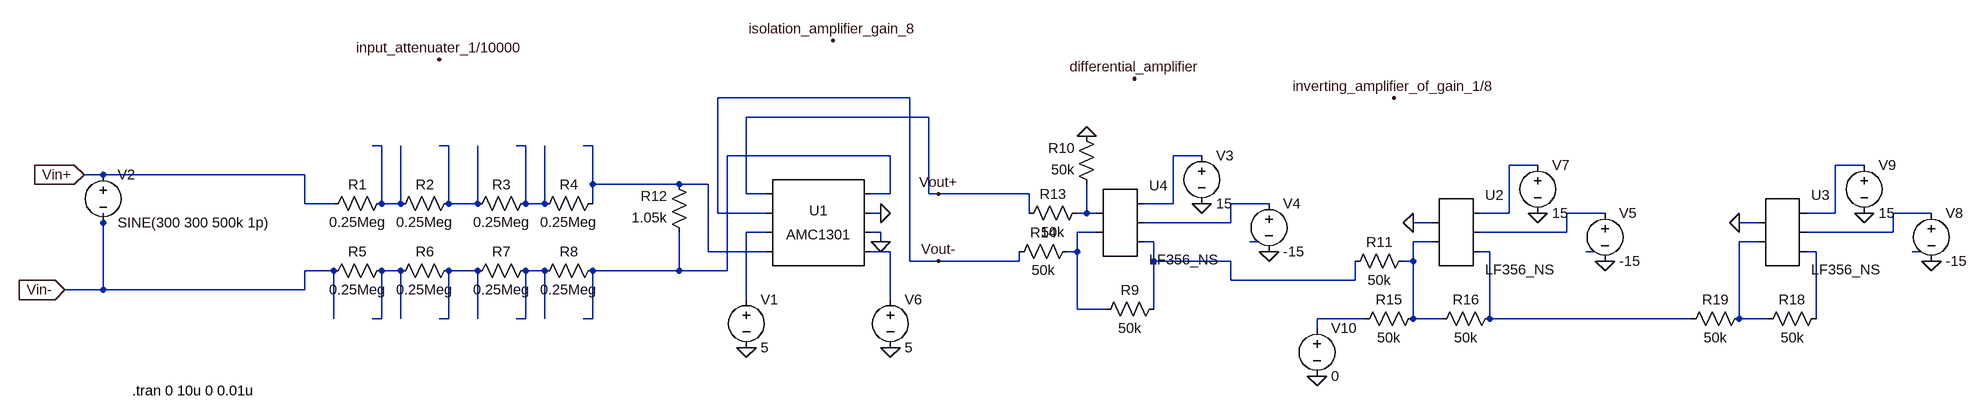
[diagram p0: schematic edl_circuit (1).asc]
edl_circuit (1).asc, the LTspice schematic file:
Version 4
SHEET 1 3028 1588
WIRE 832 -64 512 -64
WIRE 864 -32 560 -32
WIRE -48 16 -64 16
WIRE 64 16 48 16
WIRE 192 16 176 16
WIRE 304 16 288 16
WIRE 800 32 528 32
WIRE 1344 32 1296 32
WIRE 1904 48 1856 48
WIRE 2448 48 2400 48
WIRE -512 64 -544 64
WIRE -176 64 -512 64
WIRE 304 80 304 16
WIRE 448 80 304 80
WIRE 496 80 448 80
WIRE 560 96 560 -32
WIRE 592 96 560 96
WIRE 800 96 800 32
WIRE 800 96 768 96
WIRE 864 96 864 -32
WIRE 880 96 864 96
WIRE 1056 96 880 96
WIRE -176 112 -176 64
WIRE -128 112 -176 112
WIRE -48 112 -48 16
WIRE -16 112 -16 16
WIRE -16 112 -48 112
WIRE 64 112 64 16
WIRE 112 112 112 16
WIRE 112 112 64 112
WIRE 192 112 192 16
WIRE 224 112 224 16
WIRE 224 112 192 112
WIRE 304 112 304 80
WIRE 1296 112 1296 32
WIRE 1296 112 1248 112
WIRE 1456 112 1392 112
WIRE 512 128 512 -64
WIRE 592 128 512 128
WIRE 784 128 768 128
WIRE 1056 128 1056 96
WIRE 1152 128 1152 80
WIRE 1152 128 1136 128
WIRE 1168 128 1152 128
WIRE 1856 128 1856 48
WIRE 1856 128 1808 128
WIRE 2016 128 1952 128
WIRE 2400 128 2400 48
WIRE 2400 128 2352 128
WIRE 2560 128 2496 128
WIRE -512 144 -512 128
WIRE 1392 144 1392 112
WIRE 1392 144 1248 144
WIRE 1728 144 1696 144
WIRE 2272 144 2240 144
WIRE 592 160 560 160
WIRE 784 160 768 160
WIRE 1168 160 1136 160
WIRE 1952 160 1952 128
WIRE 1952 160 1808 160
WIRE 2496 160 2496 128
WIRE 2496 160 2352 160
WIRE 784 176 784 160
WIRE 1264 176 1248 176
WIRE 1440 176 1424 176
WIRE 1728 176 1696 176
WIRE 2272 176 2240 176
WIRE 496 192 496 80
WIRE 592 192 496 192
WIRE 800 192 768 192
WIRE 1136 192 1136 160
WIRE 1136 192 1120 192
WIRE 1824 192 1808 192
WIRE 2000 192 1984 192
WIRE 2368 192 2352 192
WIRE 2544 192 2528 192
WIRE 832 208 832 -64
WIRE 880 208 832 208
WIRE 1040 208 1040 192
WIRE 1040 208 880 208
WIRE 1264 208 1264 176
WIRE 1392 208 1264 208
WIRE 1696 208 1696 176
WIRE 1696 208 1680 208
WIRE -128 224 -176 224
WIRE -16 224 -48 224
WIRE 112 224 64 224
WIRE 224 224 192 224
WIRE 448 224 448 160
WIRE 448 224 304 224
WIRE 528 224 528 32
WIRE 528 224 448 224
WIRE 1392 240 1392 208
WIRE 1600 240 1600 208
WIRE 1600 240 1392 240
WIRE -512 256 -512 144
WIRE -512 256 -576 256
WIRE -176 256 -176 224
WIRE -176 256 -512 256
WIRE 560 272 560 160
WIRE 800 272 800 192
WIRE 1136 288 1136 192
WIRE 1184 288 1136 288
WIRE 1264 288 1264 208
WIRE -128 304 -128 224
WIRE -48 304 -48 224
WIRE -48 304 -64 304
WIRE -16 304 -16 224
WIRE 64 304 64 224
WIRE 64 304 48 304
WIRE 112 304 112 224
WIRE 192 304 192 224
WIRE 192 304 176 304
WIRE 224 304 224 224
WIRE 304 304 304 224
WIRE 304 304 288 304
WIRE 1616 304 1536 304
WIRE 1696 304 1696 208
WIRE 1744 304 1696 304
WIRE 1824 304 1824 192
WIRE 2160 304 1824 304
WIRE 2240 304 2240 176
WIRE 2288 304 2240 304
WIRE 2368 304 2368 192
WIRE 1536 320 1536 304
FLAG 784 176 0
FLAG 560 352 0
FLAG -544 64 Vin+
IOPIN -544 64 In
FLAG -576 256 Vin-
IOPIN -576 256 In
FLAG 880 96 Vout+
FLAG 880 208 Vout-
FLAG 1344 112 0
FLAG 1456 192 0
FLAG 1232 -96 differential_amplifier
FLAG 1664 -64 inverting_amplifier_of_gain_1/8
FLAG 704 -160 isolation_amplifier_gain_8
FLAG 48 -128 input_attenuater_1/10000
FLAG 1152 0 0
FLAG 800 352 0
FLAG 784 128 0
FLAG 1904 128 0
FLAG 2016 208 0
FLAG 1696 144 0
FLAG 2448 128 0
FLAG 2560 208 0
FLAG 2240 144 0
FLAG 1536 400 0
DATAFLAG -416 64 "$-V(Vin-)"
SYMBOL res -32 96 R90
WINDOW 0 0 56 VBottom 2
WINDOW 3 32 56 VTop 2
SYMATTR InstName R1
SYMATTR Value 0.25Meg
SYMBOL res 80 96 R90
WINDOW 0 0 56 VBottom 2
WINDOW 3 32 56 VTop 2
SYMATTR InstName R2
SYMATTR Value 0.25Meg
SYMBOL res 208 96 R90
WINDOW 0 0 56 VBottom 2
WINDOW 3 32 56 VTop 2
SYMATTR InstName R3
SYMATTR Value 0.25Meg
SYMBOL res 320 96 R90
WINDOW 0 0 56 VBottom 2
WINDOW 3 32 56 VTop 2
SYMATTR InstName R4
SYMATTR Value 0.25Meg
SYMBOL res -32 208 R90
WINDOW 0 0 56 VBottom 2
WINDOW 3 32 56 VTop 2
SYMATTR InstName R5
SYMATTR Value 0.25Meg
SYMBOL res 80 208 R90
WINDOW 0 0 56 VBottom 2
WINDOW 3 32 56 VTop 2
SYMATTR InstName R6
SYMATTR Value 0.25Meg
SYMBOL res 208 208 R90
WINDOW 0 0 56 VBottom 2
WINDOW 3 32 56 VTop 2
SYMATTR InstName R7
SYMATTR Value 0.25Meg
SYMBOL res 320 208 R90
WINDOW 0 0 56 VBottom 2
WINDOW 3 32 56 VTop 2
SYMATTR InstName R8
SYMATTR Value 0.25Meg
SYMBOL voltage 560 256 R0
WINDOW 123 0 0 Left 0
WINDOW 39 0 0 Left 0
SYMATTR InstName V1
SYMATTR Value 5
SYMBOL voltage -512 48 R0
WINDOW 39 0 0 Left 0
SYMATTR Value2 AC 10
SYMATTR InstName V2
SYMATTR Value SINE(300 300 500k 1p)
SYMBOL AutoGenerated\\AMC1301 672 144 R0
SYMATTR InstName U1
SYMBOL res 1136 176 R90
WINDOW 0 0 56 VBottom 2
WINDOW 3 32 56 VTop 2
SYMATTR InstName R14
SYMATTR Value 50k
SYMBOL voltage 1456 96 R0
WINDOW 123 0 0 Left 0
WINDOW 39 0 0 Left 0
SYMATTR InstName V4
SYMATTR Value -15
SYMBOL voltage 1344 16 R0
WINDOW 123 0 0 Left 0
WINDOW 39 0 0 Left 0
SYMATTR InstName V3
SYMATTR Value 15
SYMBOL res 1152 112 R90
WINDOW 0 0 56 VBottom 2
WINDOW 3 32 56 VTop 2
SYMATTR InstName R13
SYMATTR Value 50k
SYMBOL AutoGenerated\\LF356_NS 1200 144 R0
SYMATTR InstName U4
SYMBOL res 1280 272 R90
WINDOW 0 0 56 VBottom 2
WINDOW 3 32 56 VTop 2
SYMATTR InstName R9
SYMATTR Value 50k
SYMBOL res 1168 96 R180
WINDOW 0 36 76 Left 2
WINDOW 3 36 40 Left 2
SYMATTR InstName R10
SYMATTR Value 50k
SYMBOL voltage 800 256 R0
WINDOW 123 0 0 Left 0
WINDOW 39 0 0 Left 0
SYMATTR InstName V6
SYMATTR Value 5
SYMBOL res 464 176 R180
WINDOW 0 36 76 Left 2
WINDOW 3 36 40 Left 2
SYMATTR InstName R12
SYMATTR Value 1.05k
SYMBOL res 1696 192 R90
WINDOW 0 0 56 VBottom 2
WINDOW 3 32 56 VTop 2
SYMATTR InstName R11
SYMATTR Value 50k
SYMBOL voltage 2016 112 R0
WINDOW 123 0 0 Left 0
WINDOW 39 0 0 Left 0
SYMATTR InstName V5
SYMATTR Value -15
SYMBOL voltage 1904 32 R0
WINDOW 123 0 0 Left 0
WINDOW 39 0 0 Left 0
SYMATTR InstName V7
SYMATTR Value 15
SYMBOL AutoGenerated\\LF356_NS 1760 160 R0
SYMATTR InstName U2
SYMBOL res 1840 288 R90
WINDOW 0 0 56 VBottom 2
WINDOW 3 32 56 VTop 2
SYMATTR InstName R16
SYMATTR Value 50k
SYMBOL res 1712 288 R90
WINDOW 0 0 56 VBottom 2
WINDOW 3 32 56 VTop 2
SYMATTR InstName R15
SYMATTR Value 50k
SYMBOL voltage 2560 112 R0
WINDOW 123 0 0 Left 0
WINDOW 39 0 0 Left 0
SYMATTR InstName V8
SYMATTR Value -15
SYMBOL voltage 2448 32 R0
WINDOW 123 0 0 Left 0
WINDOW 39 0 0 Left 0
SYMATTR InstName V9
SYMATTR Value 15
SYMBOL AutoGenerated\\LF356_NS 2304 160 R0
SYMATTR InstName U3
SYMBOL res 2384 288 R90
WINDOW 0 0 56 VBottom 2
WINDOW 3 32 56 VTop 2
SYMATTR InstName R18
SYMATTR Value 50k
SYMBOL res 2256 288 R90
WINDOW 0 0 56 VBottom 2
WINDOW 3 32 56 VTop 2
SYMATTR InstName R19
SYMATTR Value 50k
SYMBOL voltage 1536 304 R0
WINDOW 123 0 0 Left 0
WINDOW 39 0 0 Left 0
SYMATTR InstName V10
SYMATTR Value 0
TEXT -464 424 Left 2 !.tran 0 10u 0 0.01u

The netlist it stands for:
* edl_circuit (1).asc
R1 N001 Vin+ 0.25Meg
R2 N002 N001 0.25Meg
R3 N003 N002 0.25Meg
R4 N004 N003 0.25Meg
R5 N024 Vin- 0.25Meg
R6 N025 N024 0.25Meg
R7 N026 N025 0.25Meg
R8 N005 N026 0.25Meg
V1 N013 0 5
V2 Vin+ Vin- SINE(300 300 500k 1p) AC 10
* U1: AMC1301 (symbol AutoGenerated\AMC1301 not available, pins judged from their places): pin1=Vout+ pin2=Vout- pin3=N013 pin4=N004 pin5=N005 pin6=0 pin7=0 pin8=N019
R14 N014 Vout- 50k
V4 N009 0 -15
V3 N006 0 15
R13 N010 Vout+ 50k
* U4: LF356_NS (symbol AutoGenerated\LF356_NS not available, pins judged from their places): pin1=N010 pin2=N014 pin3=N006 pin4=N009 pin5=N015
R9 N015 N014 50k
R10 N010 0 50k
V6 N019 0 5
R12 N005 N004 1.05k
R11 N017 N015 50k
V5 N011 0 -15
V7 N007 0 15
* U2: LF356_NS (symbol AutoGenerated\LF356_NS not available, pins judged from their places): pin1=0 pin2=N017 pin3=N007 pin4=N011 pin5=N020
R16 N020 N017 50k
R15 N017 N027 50k
V8 N012 0 -15
V9 N008 0 15
* U3: LF356_NS (symbol AutoGenerated\LF356_NS not available, pins judged from their places): pin1=0 pin2=N018 pin3=N008 pin4=N012 pin5=N022
R18 N022 N018 50k
R19 N018 N020 50k
V10 N027 0 0
.tran 0 10u 0 0.01u
.backanno
.end